# EasyEDA board source .epro
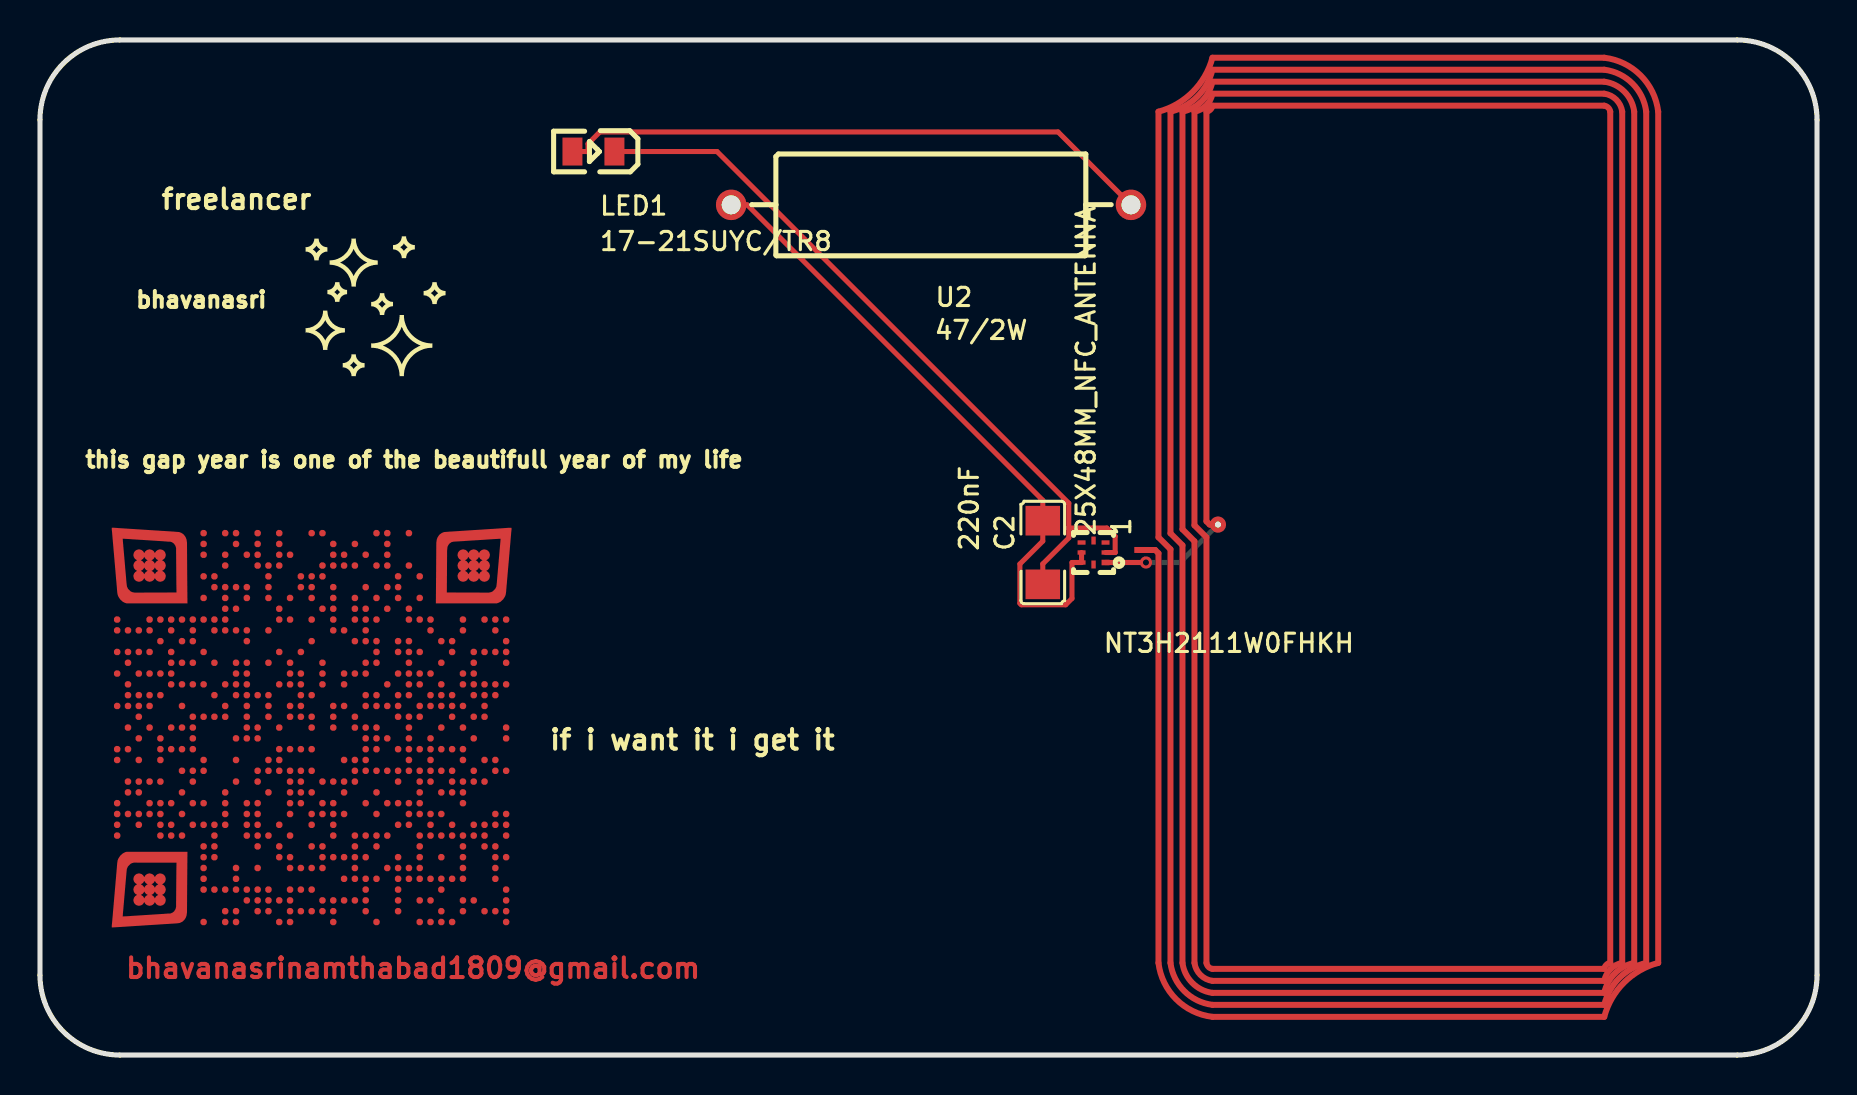
[diagram p0: board, top side]
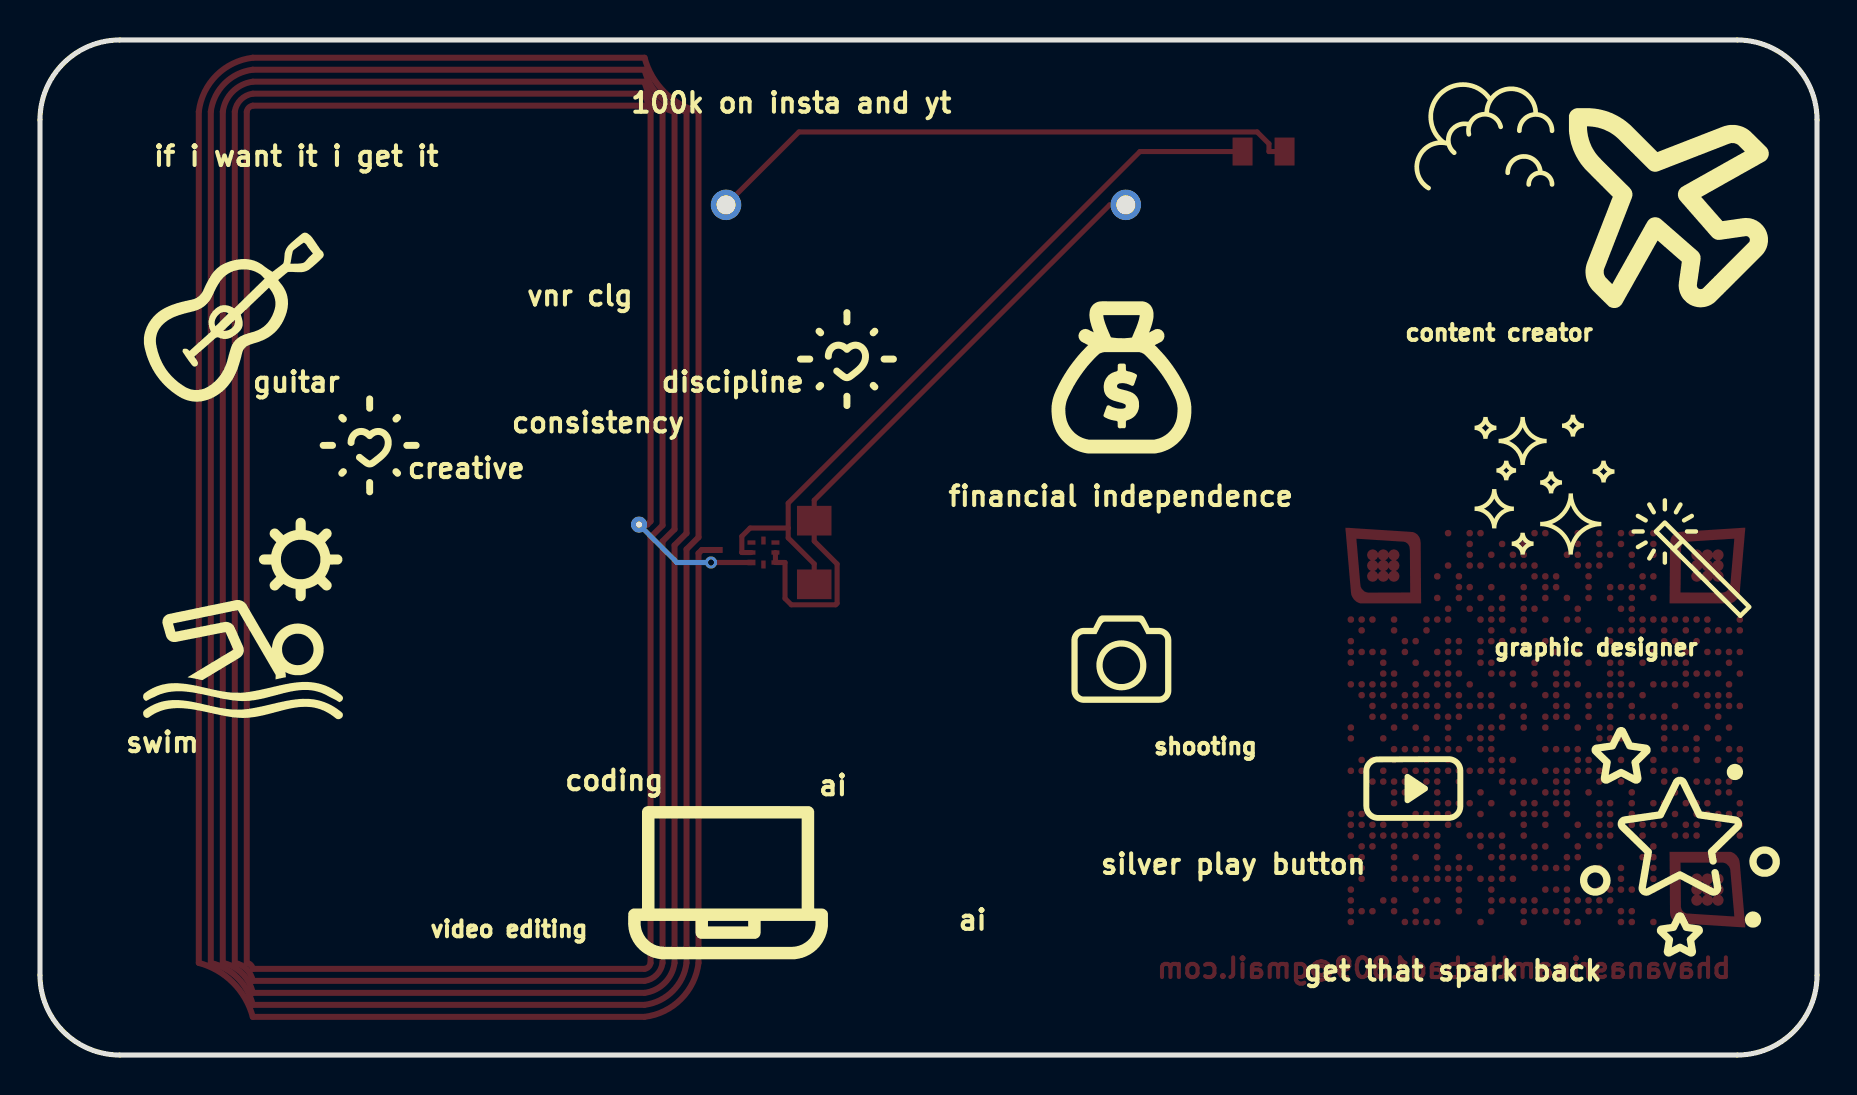
[diagram p1: board, bottom side, seen from below]

Outline 88.9 x 50.8 mm; copper layers: TopLayer, BottomLayer. Coordinates in mm from the lower left corner of the outline.
Outline path: 0,46.8 arc(1.17,49.63) 4,50.8 84.9,50.8 arc(87.73,49.63) 88.9,46.8 88.9,4 arc(87.73,1.17) 84.9,0 4,0 arc(1.17,1.17) 0,4 0,46.8

## Design rules (mm)
Default: track 0.254, clearance 0.152, via 0.61, via hole 0.305

## Placement (name value [footprint] x y rotation side)
1  -  [25X48MM_NFC_ANTENNA]  68.46 25.91 90 top
C2  220nF  [C1206]  50.17 25.15 90 top
LED1  17-21SUYC/TR8  [LED0805-R-RD]  27.69 45.22 180 top
U1  NT3H2111W0FHKH  [XQFN-8_L1.6-W1.6-P0.50-BL_NT3H2111W0FHKH]  52.71 25.15 180 top
U2  47/2W  [RES-TH_BD5.0-L15.5-P20.00-D0.7]  44.58 42.55 180 top

## Footprints (pads in the part's own frame, mm; a bottom-side part is the same pattern mirrored in y, then rotated)
25X48MM_NFC_ANTENNA
  rect 0.3x0.75 smd: P$1(-0.635,13.335)
  oval 0.808x0.808 hole 0.3x0.3: P$2(0.635,9.525)
C1206
  rect 1.485x1.728 smd: 1(-1.593,0) 2(1.593,0)
LED0805-R-RD
  rect 1x1.399 smd: 1(1.05,0) 2(-1.05,0)
RES-TH_BD5.0-L15.5-P20.00-D0.7
  oval 1.524x1.524 hole 0.95: 1(-10,0) 2(10,0)
XQFN-8_L1.6-W1.6-P0.50-BL_NT3H2111W0FHKH
  rect 0.4x0.28 smd: 1(-0.6,0.5)
  rect 0.4x0.22 smd: 2(-0.6,0) 3(-0.6,-0.5) 5(0.6,-0.5) 6(0.6,0) 7(0.6,0.5)
  rect 0.22x0.4 smd: 4(0,-0.6) 8(0,0.6)

## Nets
LED1_1: LED1.1 U2.1
U1_1: 1.P$2 U1.1
U1_2: C2.1 LED1.2 U1.2
U1_3: U1.3
U1_4: U1.4
U1_5: U1.5
U1_6: C2.2 U1.6 U1.7 U2.2
U1_8: 1.P$1 U1.8

## Via types
v1: diameter 0.61, hole 0.305, TopLayer to BottomLayer, 1 via

## Routing (per net, layer and track width the routed paths; a pad name or vN(x,y) marks a point on that pad's centre or on a via; arc(x,y) is an arc through that point)
LED1_1: length 30.1
  TopLayer w0.254: LED1.1 27.42,45.22 27.42,45.61 28.01,46.2 50.93,46.2 U2.1
U1_1: length 28
  TopLayer w0.254: 58.65,47.51 58.63,47.51 58.6,47.51 58.58,47.5 58.56,47.49 58.53,47.49 58.51,47.47 58.49,47.46 58.47,47.45 58.45,47.43 58.43,47.41 58.42,47.39 58.4,47.37 58.39,47.35 58.38,47.33 58.37,47.31 58.36,47.28 58.36,47.26 58.36,47.24 58.35,47.21 58.35,26.71 58.52,26.55 1.P$2 ; U1.1 v1(55.33,24.65)
  BottomLayer w0.254: v1(55.33,24.65) 57.03,24.65 1.P$2
U1_2: length 38.4
  TopLayer w0.254: 51.47,26.37 51.47,27.62 33.87,45.22 LED1.2 ; 51.47,26.37 53.37,26.37 53.79,25.96 53.79,25.15 53.79,25.15 53.31,25.15 ; 51.47,26.37 51.47,25.88 50.17,24.58 C2.1
U1_6: length 32.9
  TopLayer w0.254: U2.2 35.38,42.55 50.17,27.76 C2.2 50.17,25.72 49.02,24.57 49.02,22.61 49.1,22.53 51.31,22.53 51.63,22.85 51.63,24.65 U1.7 52.11,25.15

Small or netless copper shapes (teardrops, artwork), in the pictures only: 587 on TopLayer

## Text on the board
BottomSilkLayer: graphic designer | content creator | shooting | video editing | get that spark back | silver play button | ai | financial independence | discipline | 100k on insta and yt | coding | vnr clg | consistency | creative | guitar | if i want it i get it | swim
TopLayer: bhavanasrinamthabad1809@gmail.com
TopSilkLayer: this gap year is one of the beautifull year of my life | bhavanasri | freelancer | if i want it i get it
